# Altium schematic sheet Step motor.SchDoc
size A4
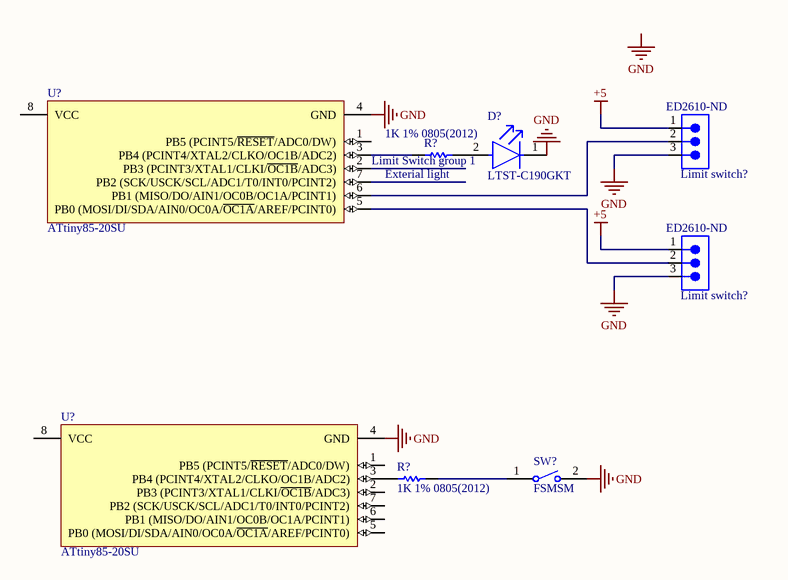
[diagram p0: Step motor.SchDoc]

## Parts
(Parts that share a designator on the sheet are numbered #1, #2 ... from top to bottom, then left to right.)
D?  LTST-C190GKT  [FP-LTST-C190GKT-MFG]
Limit_switch?#1  Supplier Part Number 2: ED2610-ND  [1x3 - OSTTC032162]  (hidden comment: 1x3 header 90120-0123)
Limit_switch?#2  Supplier Part Number 2: ED2610-ND  [1x3 - OSTTC032162]  (hidden comment: 1x3 header 90120-0123)
R?#1  1K 1% 0805(2012)  [RESC0805(2012)_M]
R?#2  1K 1% 0805(2012)  [RESC0805(2012)_M]
SW?  FSMSM  [TECO-FSMSM-2_V]
U?#1  ATtiny85-20SU  [8S2_M]
U?#2  ATtiny85-20SU  [8S2_M]

## Nets
+5: Limit_switch?#1.1 Limit_switch?#2.1
GND: D?.1(C) Limit_switch?#1.3 Limit_switch?#2.3 SW?.2 U?#1.4(GND) U?#2.4(GND)
NetD?_2: D?.2(A) R?#1.2
NetLimit_switch?#1_2: Limit_switch?#1.2 U?#1.6(PB1_(MISO/DO/AIN1/OC0B/OC1A/PCINT1))
NetLimit_switch?#2_2: Limit_switch?#2.2 U?#1.5(PB0_(MOSI/DI/SDA/AIN0/OC0A/~{OC1A}/AREF/PCINT0))
NetR?#1_1: R?#1.1 U?#1.3(PB4_(PCINT4/XTAL2/CLKO/OC1B/ADC2))
NetR?#2_1: R?#2.1 U?#2.3(PB4_(PCINT4/XTAL2/CLKO/OC1B/ADC2))
NetR?#2_2: R?#2.2 SW?.1

Not connected (* = marked no-connect by the designer): U?#1 1(PB5_(PCINT5/~{RESET}/ADC0/DW)) 2(PB3_(PCINT3/XTAL1/CLKI/~{OC1B}/ADC3)) 7(PB2_(SCK/USCK/SCL/ADC1/T0/INT0/PCINT2)) 8(VCC); U?#2 1(PB5_(PCINT5/~{RESET}/ADC0/DW)) 2(PB3_(PCINT3/XTAL1/CLKI/~{OC1B}/ADC3)) 5(PB0_(MOSI/DI/SDA/AIN0/OC0A/~{OC1A}/AREF/PCINT0)) 6(PB1_(MISO/DO/AIN1/OC0B/OC1A/PCINT1)) 7(PB2_(SCK/USCK/SCL/ADC1/T0/INT0/PCINT2)) 8(VCC)

## Notes on the sheet
- Limit Switch group 1
- (near R?#1) Exterial light
- Labels drawn without touching a wire or pin: GND

## Library data of the parts
D? = CMP-22017-000018-1: LED GREEN CLEAR CHIP SMD; Dominant Wavelength: 569nm; Reverse Voltage: 5V; Lens Color: Colorless; Viewing Angle: 130°; Voltage: 2V; Forward Current: 30mA; Power Dissipation: 100mW; Luminous Intensity: 6mcd; Number of LEDs: 1; Forward Voltage: 2.1V; Wavelength: 565nm; Test Current: 10mA; Min Operating Temperature: -55°C; Lens Style: Clear; Mount: Surface Mount; Width: 0.8mm; Packaging: Tape and Reel; Lens Transparency: Clear; Case Code (Metric): 1608; Depth: 0.8mm; Case Code (Imperial): 0603; Case/Package: 0603; Number of Pins: 2; Max Operating Temperature: 85°C; Lead Free: Lead Free; Number of Elements: 1; Length: 1.6mm; Height: 0.8mm; Package Quantity: 1; Power Rating: 100mW; Radiation Hardening: No; Illumination Color: Green; Color: Green
Limit_switch?#1 Limit_switch?#2 = 1x3 header 90120-0123: HDR 1x3, 2.54mm Pitch, Vert TH; Manufacturer: Molex; Plating: Steel; Max Current Rating: 15A; Number of Levels: 1; Number of Positions Per Level: 3; Voltage: 300V; Wire Gauge (Max): 22AWG; Wire Gauge (Min): 14AWG; Pitch: 0.2inch; Manufacturer Part #: 90120-0123; Supplier Part Number 1: WM8073-ND; Cost: 0.57; Supplier 1: Digi-Key; RoHS: Y; Supplier 2: Digi-Key; Manufacturer 2: On-Shore Technology; Manufacturer Part Number 2: OSTTC032162; Stock 2: 6880; Pricing 2: 1=0.85000, 10=0.53000, 25=0.45400, 50=0.40800, 100=0.39950, 250=0.34000, 500=0.32300, 1000=0.28900, 5000=0.22610 (USD); Mount: Through Hole; Color: Blue; Contact Plating: Tin; Housing Color: Blue; Contact Material: Brass; Housing Material: Thermoplastic; Min Operating Temperature: -30°C; Max Operating Temperature: 105°C; Packaging: Bulk; Number of Rows: 1; Current: 15A; Termination: Screw; Number of Contacts: 3; Number of Positions: 3; Length: 15.2mm; Height: 10mm; Width: 7.6mm; Lead Free: Lead Free; Flammability Rating: UL94 V-0; ComponentLink1URL: https://datasheet.ciiva.com/823/osttcxx2162-823568.pdf?src-supplier=Digi-Key; ComponentLink1Description: https://datasheet.ciiva.com/823/osttcxx2162-823568.pdf?src-supplier=Digi-Key; ComponentLink2URL: https://datasheet.ciiva.com/19458/2120655-19458972.pdf?src-supplier=Jameco; ComponentLink2Description: https://datasheet.ciiva.com/19458/2120655-19458972.pdf?src-supplier=Jameco
R?#1 R?#2 = CMP-1013-00510-1: 1K 0.125W 1% 0805 (2012 Metric)  SMD; Case-Metric: 2012; Value: 1000.00 Ohm; Case-EIA: 0805; Tolerance: 1 %; Power: 0.125 W; Technology: SMT
SW? = CMP-2000-07511-1: FSMSM Push Button Switch, 50 mA, -35 to 85 degC, 2-Pin SMD, RoHS, Bulk; Manufacturer: TE Connectivity; Actuator Length: 1.07mm; Electrical Life: 20000Cycles; Actuator Material: Polyamide; Current Rating: 50mA; Illumination Type: Illuminated; Voltage Rating (DC): 24V; Contact Resistance: 100mOhm; Case\/Package: SMD/SMT; Operating Force: 180gf; Switch Travel: 0.25mm; Max Voltage Rating (DC): 12V; Throw Configuration: SPST; Packaging: LoosePiece; Max Operating Temperature: 85degC; ELV: Compliant; Package Description: 2-Pin Surface Mount Device, Body 6 x 3.5 mm, Pitch 9.19 mm; RoHSCompliant: true; Manufacturer URL: http://www.te.com/; Contact Plating: Silver; Contact Material: Brass; Mounting Technology: SurfaceMount; Contact Current Rating: 50mA; Datasheet Version: Rev. C2, 08/2014; Datasheet URL: http://www.te.com/commerce/DocumentDelivery/DDEController?Action=showdoc&DocId=Customer+Drawing%7F1437566-3%7FC2%7Fpdf%7FEnglish%7FENG_CD_1437566-3_C2_1437566_3_1_c.dwg.pdf%7F1437566-3; Mechanical Life: 20000Cycles; Package Reference: FSMSM; REACH SVHC: Unknown; Orientation: Straight; Min Operating Temperature: -35degC; Lead Free: LeadFree; Termination: GullWing; Package Quantity: 1000; Mount: SurfaceMount
U?#1 U?#2 = CMP-0093-00173-2: 8-bit AVR Microcontroller, 20MHz, 2.7-5.5V, 8K Flash, 512 Bytes EEPROM, 512 Bytes SRAM, Industrial Grade (-40°C to 85°C), 8-Lead SOIC, Pb-Free; ComponentLink3Description: ATtiny25/45/85 Summary; DatasheetVersion: revN, Apr-2011; PackageVersion: revF, Apr-2008; ComponentLink3URL: http://www.atmel.com/dyn/resources/prod_documents/2586S.pdf; ComponentLink1URL: http://www.atmel.com/; ComponentLink2Description: ATtiny25/45/85 Datasheet; RevisionNote: DatasheetVersion updated. URLs added.; PackageDescription: 8-Lead, 0.208" Body, Plastic Small Outline Package (EIAJ); ComponentLink1Description: Manufacturer URL; PackageReference: 8S2; ComponentLink2URL: http://www.atmel.com/dyn/resources/prod_documents/doc2586.pdf